# EAGLE design mutebox (EAGLE 6.3)

## Sheet 1 of 2
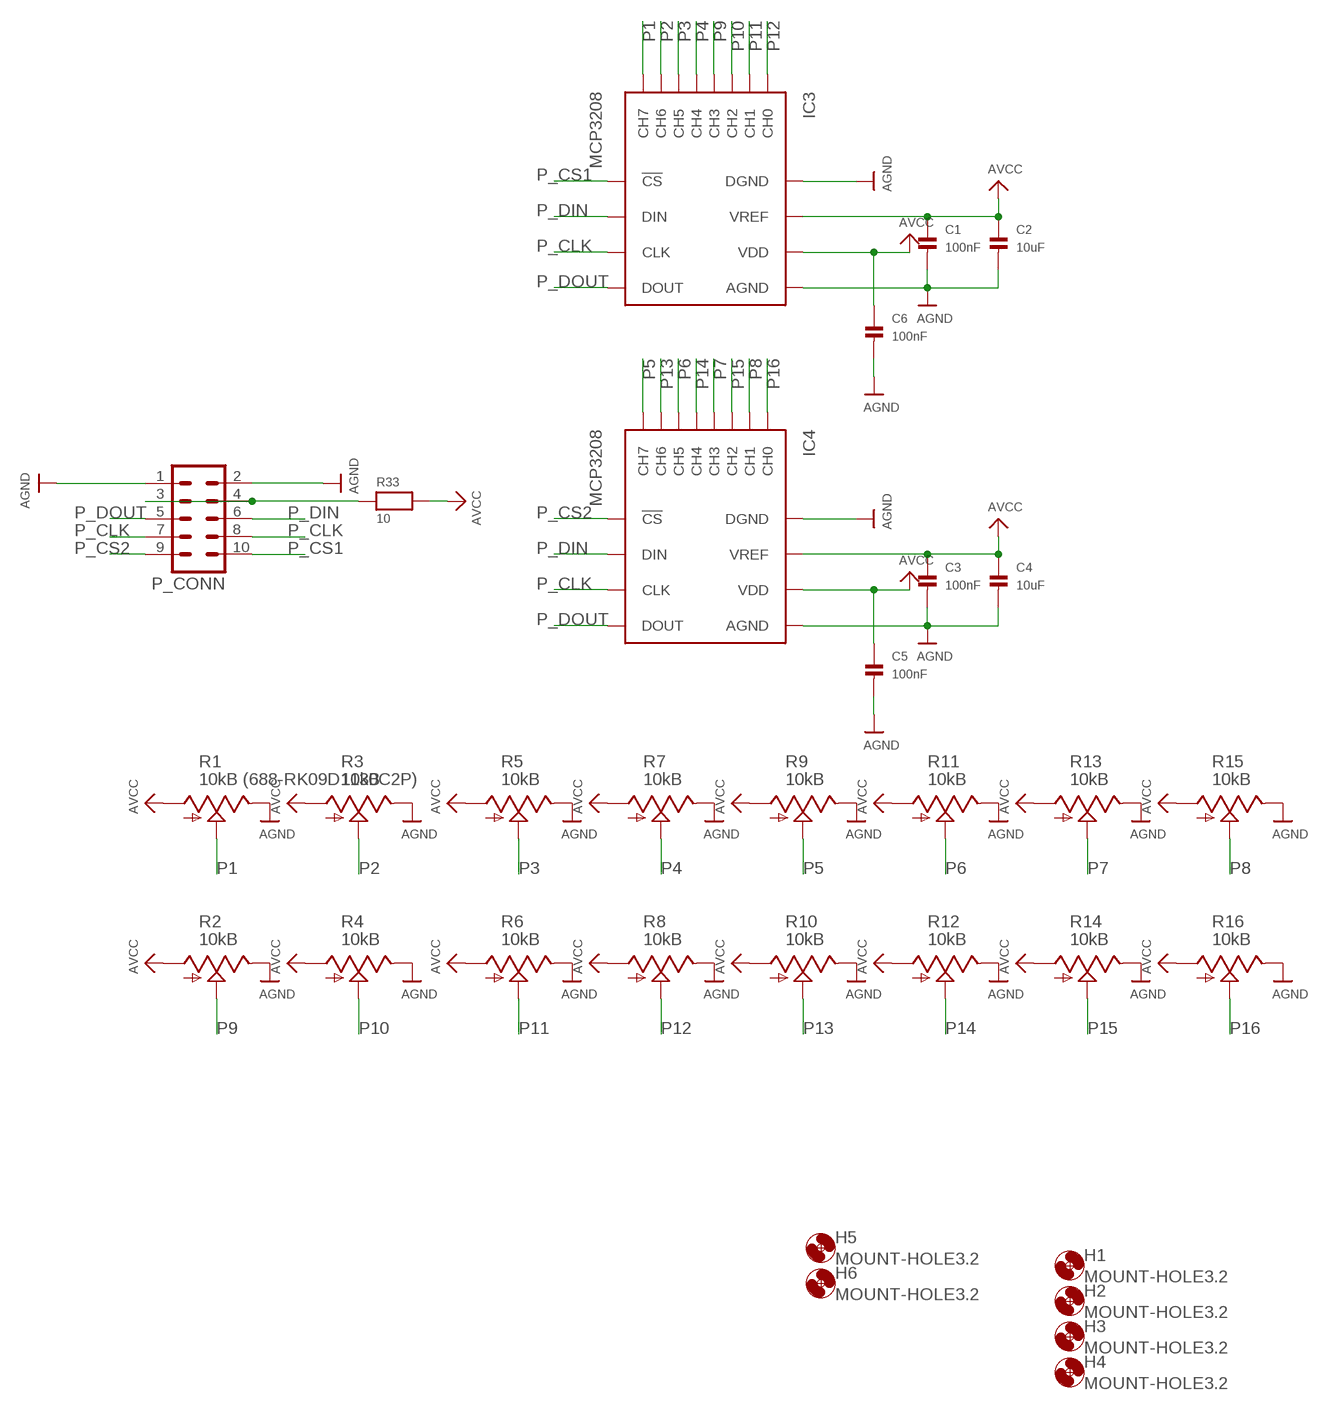
[diagram p0: schematic, sheet 1]

### Parts
C1  100nF  CAP_CERAMIC0603  [0603]
C2  10uF  CAP_CERAMIC_0805  [_0805]
C3  100nF  CAP_CERAMIC0603  [0603]
C4  10uF  CAP_CERAMIC_0805  [_0805]
C5  100nF  CAP_CERAMIC0603  [0603]
C6  100nF  CAP_CERAMIC0603  [0603]
H1  MOUNT-HOLE3.2  [3,2]
H2  MOUNT-HOLE3.2  [3,2]
H3  MOUNT-HOLE3.2  [3,2]
H4  MOUNT-HOLE3.2  [3,2]
H5  MOUNT-HOLE3.2  [3,2]
H6  MOUNT-HOLE3.2  [3,2]
IC3  MCP3208  21298E  [PDIP16]
IC4  MCP3208  21298E  [PDIP16]
P_CONN  ML10  [ML10]
R1  10kB (688-RK09D1130C2P)  POT_USVERTICAL_PS  [ALPS_POT_VERTICAL_PS]
R2  10kB  POT_USVERTICAL_PS  [ALPS_POT_VERTICAL_PS]
R3  10kB  POT_USVERTICAL_PS  [ALPS_POT_VERTICAL_PS]
R4  10kB  POT_USVERTICAL_PS  [ALPS_POT_VERTICAL_PS]
R5  10kB  POT_USVERTICAL_PS  [ALPS_POT_VERTICAL_PS]
R6  10kB  POT_USVERTICAL_PS  [ALPS_POT_VERTICAL_PS]
R7  10kB  POT_USVERTICAL_PS  [ALPS_POT_VERTICAL_PS]
R8  10kB  POT_USVERTICAL_PS  [ALPS_POT_VERTICAL_PS]
R9  10kB  POT_USVERTICAL_PS  [ALPS_POT_VERTICAL_PS]
R10  10kB  POT_USVERTICAL_PS  [ALPS_POT_VERTICAL_PS]
R11  10kB  POT_USVERTICAL_PS  [ALPS_POT_VERTICAL_PS]
R12  10kB  POT_USVERTICAL_PS  [ALPS_POT_VERTICAL_PS]
R13  10kB  POT_USVERTICAL_PS  [ALPS_POT_VERTICAL_PS]
R14  10kB  POT_USVERTICAL_PS  [ALPS_POT_VERTICAL_PS]
R15  10kB  POT_USVERTICAL_PS  [ALPS_POT_VERTICAL_PS]
R16  10kB  POT_USVERTICAL_PS  [ALPS_POT_VERTICAL_PS]
R33  10  RESISTOR_0805  [_0805]

### Nets
AGND: C1.2 C2.2 C3.2 C4.2 C5.2 C6.2 IC3.P$9(DGND) IC3.P$14(AGND) IC4.P$9(DGND) IC4.P$14(AGND) P_CONN.1 P_CONN.2 R1.P$1(E) R2.P$1(E) R3.P$1(E) R4.P$1(E) R5.P$1(E) R6.P$1(E) R7.P$1(E) R8.P$1(E) R9.P$1(E) R10.P$1(E) R11.P$1(E) R12.P$1(E) R13.P$1(E) R14.P$1(E) R15.P$1(E) R16.P$1(E)
AVCC: C1.1 C2.1 C3.1 C4.1 C5.1 C6.1 IC3.P$15(VREF) IC3.P$16(VDD) IC4.P$15(VREF) IC4.P$16(VDD) R1.P$3(A) R2.P$3(A) R3.P$3(A) R4.P$3(A) R5.P$3(A) R6.P$3(A) R7.P$3(A) R8.P$3(A) R9.P$3(A) R10.P$3(A) R11.P$3(A) R12.P$3(A) R13.P$3(A) R14.P$3(A) R15.P$3(A) R16.P$3(A) R33.2
N$9: P_CONN.3 P_CONN.4 R33.1
P1: IC3.P$8(CH7) R1.P$2(S)
P2: IC3.P$7(CH6) R3.P$2(S)
P3: IC3.P$6(CH5) R5.P$2(S)
P4: IC3.P$5(CH4) R7.P$2(S)
P5: IC4.P$8(CH7) R9.P$2(S)
P6: IC4.P$6(CH5) R11.P$2(S)
P7: IC4.P$4(CH3) R13.P$2(S)
P8: IC4.P$2(CH1) R15.P$2(S)
P9: IC3.P$4(CH3) R2.P$2(S)
P10: IC3.P$3(CH2) R4.P$2(S)
P11: IC3.P$2(CH1) R6.P$2(S)
P12: IC3.P$1(CH0) R8.P$2(S)
P13: IC4.P$7(CH6) R10.P$2(S)
P14: IC4.P$5(CH4) R12.P$2(S)
P15: IC4.P$3(CH2) R14.P$2(S)
P16: IC4.P$1(CH0) R16.P$2(S)
P_CLK: IC3.P$13(CLK) IC4.P$13(CLK) P_CONN.7 P_CONN.8
P_CS1: IC3.P$10(!CS) P_CONN.10
P_CS2: IC4.P$10(!CS) P_CONN.9
P_DIN: IC3.P$11(DIN) IC4.P$11(DIN) P_CONN.6
P_DOUT: IC3.P$12(DOUT) IC4.P$12(DOUT) P_CONN.5

## Sheet 2 of 2
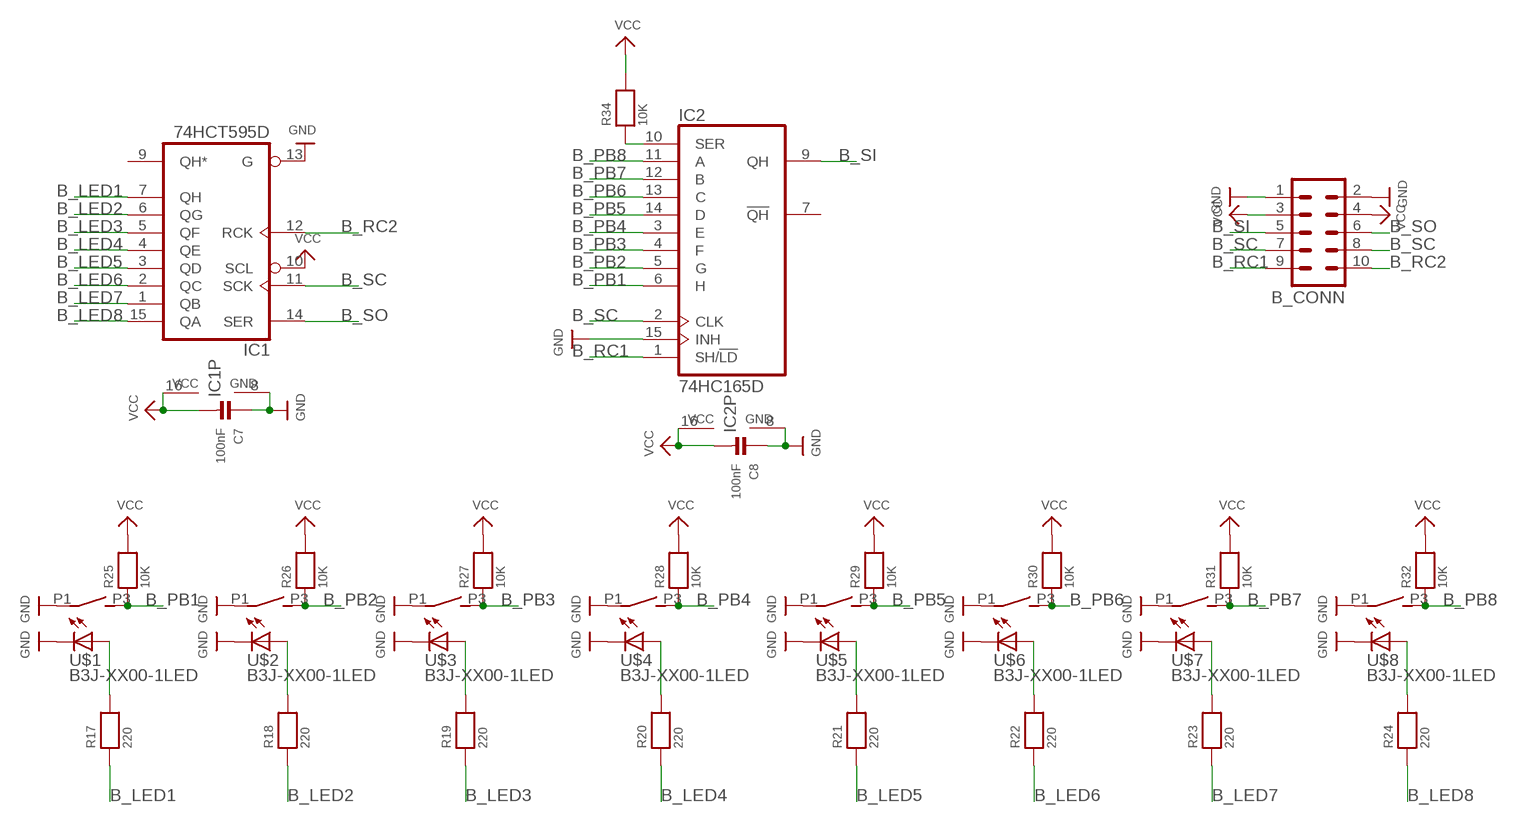
[diagram p1: schematic, sheet 2]

### Parts
B_CONN  ML10  [ML10]
C7  100nF  CAP_CERAMIC0603  [0603]
C8  100nF  CAP_CERAMIC0603  [0603]
IC1  74HCT595D  [SO16]
IC2  74HC165D  [SO16]
R17  220  RESISTOR_0603  [_0603]
R18  220  RESISTOR_0603  [_0603]
R19  220  RESISTOR_0603  [_0603]
R20  220  RESISTOR_0603  [_0603]
R21  220  RESISTOR_0603  [_0603]
R22  220  RESISTOR_0603  [_0603]
R23  220  RESISTOR_0603  [_0603]
R24  220  RESISTOR_0603  [_0603]
R25  10K  RESISTOR_0603  [_0603]
R26  10K  RESISTOR_0603  [_0603]
R27  10K  RESISTOR_0603  [_0603]
R28  10K  RESISTOR_0603  [_0603]
R29  10K  RESISTOR_0603  [_0603]
R30  10K  RESISTOR_0603  [_0603]
R31  10K  RESISTOR_0603  [_0603]
R32  10K  RESISTOR_0603  [_0603]
R34  10K  RESISTOR_0603  [_0603]
U$1  B3J-XX00-1LED  [B3J-XX00-1LED]
U$2  B3J-XX00-1LED  [B3J-XX00-1LED]
U$3  B3J-XX00-1LED  [B3J-XX00-1LED]
U$4  B3J-XX00-1LED  [B3J-XX00-1LED]
U$5  B3J-XX00-1LED  [B3J-XX00-1LED]
U$6  B3J-XX00-1LED  [B3J-XX00-1LED]
U$7  B3J-XX00-1LED  [B3J-XX00-1LED]
U$8  B3J-XX00-1LED  [B3J-XX00-1LED]

### Nets
B_LED1: IC1.7(QH) R17.1
B_LED2: IC1.6(QG) R18.1
B_LED3: IC1.5(QF) R19.1
B_LED4: IC1.4(QE) R20.1
B_LED5: IC1.3(QD) R21.1
B_LED6: IC1.2(QC) R22.1
B_LED7: IC1.1(QB) R23.1
B_LED8: IC1.15(QA) R24.1
B_PB1: IC2.6(H) R25.1 U$1.P3(SW2)
B_PB2: IC2.5(G) R26.1 U$2.P3(SW2)
B_PB3: IC2.4(F) R27.1 U$3.P3(SW2)
B_PB4: IC2.3(E) R28.1 U$4.P3(SW2)
B_PB5: IC2.14(D) R29.1 U$5.P3(SW2)
B_PB6: IC2.13(C) R30.1 U$6.P3(SW2)
B_PB7: IC2.12(B) R31.1 U$7.P3(SW2)
B_PB8: IC2.11(A) R32.1 U$8.P3(SW2)
B_RC1: B_CONN.9 IC2.1(SH/!LD)
B_RC2: B_CONN.10 IC1.12(RCK)
B_SC: B_CONN.7 B_CONN.8 IC1.11(SCK) IC2.2(CLK)
B_SI: B_CONN.5 IC2.9(QH)
B_SO: B_CONN.6 IC1.14(SER)
GND: B_CONN.1 B_CONN.2 C7.1 C8.1 IC1.8(GND) IC1.13(G) IC2.8(GND) IC2.15(INH) U$1.LED- U$1.P1(SW1) U$2.LED- U$2.P1(SW1) U$3.LED- U$3.P1(SW1) U$4.LED- U$4.P1(SW1) U$5.LED- U$5.P1(SW1) U$6.LED- U$6.P1(SW1) U$7.LED- U$7.P1(SW1) U$8.LED- U$8.P1(SW1)
N$1: R17.2 U$1.LED+
N$2: R18.2 U$2.LED+
N$3: R19.2 U$3.LED+
N$4: R20.2 U$4.LED+
N$5: R21.2 U$5.LED+
N$6: R22.2 U$6.LED+
N$7: R23.2 U$7.LED+
N$8: R24.2 U$8.LED+
N$10: IC2.10(SER) R34.1
VCC: B_CONN.3 B_CONN.4 C7.2 C8.2 IC1.10(SCL) IC1.16(VCC) IC2.16(VCC) R25.2 R26.2 R27.2 R28.2 R29.2 R30.2 R31.2 R32.2 R34.2
Unconnected: IC1.9(QH*) IC2.7(!QH)

## Library data of the parts
B_CONN P_CONN = con-harting-ml:ML10: HARTING; OC_FARNELL: unknown; OC_NEWARK: unknown
C1-C8 = microbuilder:CAP_CERAMIC: Ceramic Capacitors 0402 - 0402 Surface Mount Capacitors 16pF 50V 5% [Digikey: 445-4899-2-ND] 18pF 50V 5% [Digikey: 490-1281-2-ND] 22pF 50V 5% [Digikey: 490-1283-2-ND] 68pF 50V 5% [Digikey: 490-1289-2-ND] 0.1uF 10V 10% [Digikey: 490-1318-2-ND] 1.0uF 6.3V 10% [Digikey: 490-1320-2-ND] 0603 - 0603 Surface Mount Capacitors 16 pF 50V 5% [Digikey: 445-5051-2-ND] 22 pF 50V [Digikey: PCC220ACVTR-ND] 33 pF 50V 5% [Digikey: 490-1415-1-ND] 56pF 50V 5% [Digikey: 490-1421-1-ND] 220pF 50V 5% [Digikey: 445-1285-1-ND] 680 pF 50V 2200 pF 50V 5% C0G [Digikey: 445-1297-1-ND] 5600 pF 100V 5% X7R [Digikey: 478-3711-1-ND] 0.1 µF 25V 10% [Digikey: PCC2277TR-ND] 0.22 µF 16V 10% X7R [Digikey: 445-1318-1-ND] 1.0 µF 25V 10% [Digikey: 445-5146-2-ND] 0603 - RF Specific 3pF 250V +/-0.1pF RF [Digikey: 712-1347-1-ND] 18 pF 250V 5% [Digikey: 478-3505-1-ND or 712-1322-1-ND] 56 pF 250V 5% C0G RF [Digikey: 490-4867-1-ND] 68 pF 250V RF [Digikey: 490-4868-1-ND] 0805 - 0805 Surface Mount Capacitors 220 pF 250V 2% RF Ceramic Capacitor [Digikey: 712-1398-1-ND] 1000 pF 50V 2% NP0 Ceramic Capacitor [Digikey: 478-3760-1-ND] 0.1 µF 25V 10% Ceramic Capacitor [Digikey: PCC1828TR-ND] 1.0 µF 16V 10% Ceramic Capacitor[Digikey: 490-1691-2-ND] 10.0 µF 10V 10% Ceramic Capacitor[Digikey: 709-1228-1-ND] 10.0 uF 16V 10% Ceramic Capacitor [Digikey: 478-5165-2-ND] 47 uF 6.3V 20% Ceramic Capacitor [Digikey: 587-1779-1-ND or 399-5506-1-ND] 1206 - 1206 Surface Mount Capacitors 47uF 10V 20% Ceramic Capacitor [Digikey: 490-5528-1-ND or 399-5508-1-ND or 445-6010-1-ND] 100uF 6.3V -20%, +80% Y5V Ceramic Capacitor (Digikey: 490-4512-1-ND, Mouser: 81-GRM31CF50J107ZE1L)
H1-H6 = holes:MOUNT-HOLE: MOUNTING HOLE with drill center marker
IC1 = 74xx-eu:74*595: 8-bit SHIFT REGISTER, output latch
IC2 = 74xx-eu:74*165: 8-bit parallel load SHIFT REGISTER
IC3 IC4 = MCP3208:21298E
R1-R16 = pot-alps:POT_US
R17-R34 = microbuilder:RESISTOR: Resistors 0402 - 0402 Surface Mount Package 22 Ohm 1% 1/16W [Digikey: 311-22.0LRTR-ND] 33 Ohm 5% 1/16W 1.0K 5% 1/16W 1.5K 5% 1/16W 2.0K 1% 1/16W 10.0K 1% 1/16W [Digikey: 311-10.0KLRTR-ND] 10.0K 5% 1/16W [Digikey: RMCF0402JT10K0TR-ND] 12.1K 1% 1/16W [Digikey: 311-22.0LRTR-ND] 100.0K 5% 1/16W 0603 - 0603 Surface Mount Package 0 Ohm 1/10 Watt 1% Resistor 15 Ohm 1/10 Watt 1% Resistor 33 Ohm 1/10 Watt 1% Resistor 49.9 Ohm 1/10 Watt 1% Resistor 100 Ohm 1/10 Watt 1% Resistor 150 Ohm 1/10 Watt 1% Resistor 240 Ohm 1/10 Watt 1% Resistor 390 Ohm 1/10 Watt 1% Resistor 560 Ohm 1/10 Watt 1% Resistor 680 Ohm 1/10 Watt 1% Resistor 750 Ohm 1/10 Watt 1% Resistor 1.0K Ohm 1/10 Watt 1% Resistor 1.5K Ohm 1/10 Watt 1% Resistor 2.0K Ohm 1/10 Watt 1% Resistor 2.2K Ohm 1/10 Watt 1% Resistor 3.3K Ohm 1/10 Watt 1% Resistor 4.7K Ohm 1/10 Watt 1% Resistor 10.0K Ohm 1/10 Watt 1% Resistor 12.0K Ohm 1/10 Watt 1% Resistor 12.1K Ohm 1/10 Watt 1% Resistor 20.0K Ohm 1/10 Watt 1% Resistor 33.0K Ohm 1/10 Watt 1% Resistor 100.0K Ohm 1/10 Watt 1% Resistor 0805 - 0805 Surface Mount Package 0 Ohm 1/8 Watt 1% Resistor 33 Ohm 1/8 Watt 1% Resistor 100 Ohm 1/8 Watt 1% Resistor 150 Ohm 1/8 Watt 1% Resistor 200 Ohm 1/8 Watt 1% Resistor 240 Ohm 1/8 Watt 1% Resistor 330 Ohm 1/8 Watt 1% Resistor 390 Ohm 1/8 Watt 1% Resistor 470 Ohm 1/8 Watt 1% Resistor 1.0K Ohm 1/8 Watt 1% Resistor 1.5K Ohm 1/8 Watt 1% Resistor 2.0K Ohm 1/8 Watt 1% Resistor 4.7K Ohm 1/8 Watt 1% Resistor 5.1K Ohm 1/8 Watt 1% Resistor 5.6K Ohm 1/8 Watt 1% Resistor 10.0K Ohm 1/8 Watt 1% Resistor 22.0K Ohm 1/8 Watt 1% Resistor 33.0K Ohm 1/8 Watt 1% Resistor 100K Ohm 1/8 Watt 1% Resistor 1206 - 1206 Surface Mount Package 2012 - 2010 Surface Mount Package 0.11 Ohm 1/2 Watt 1% Resistor - Digikey: RHM.11UCT-ND
U$1-U$8 = keves:B3J-XX00-1LED

## Board
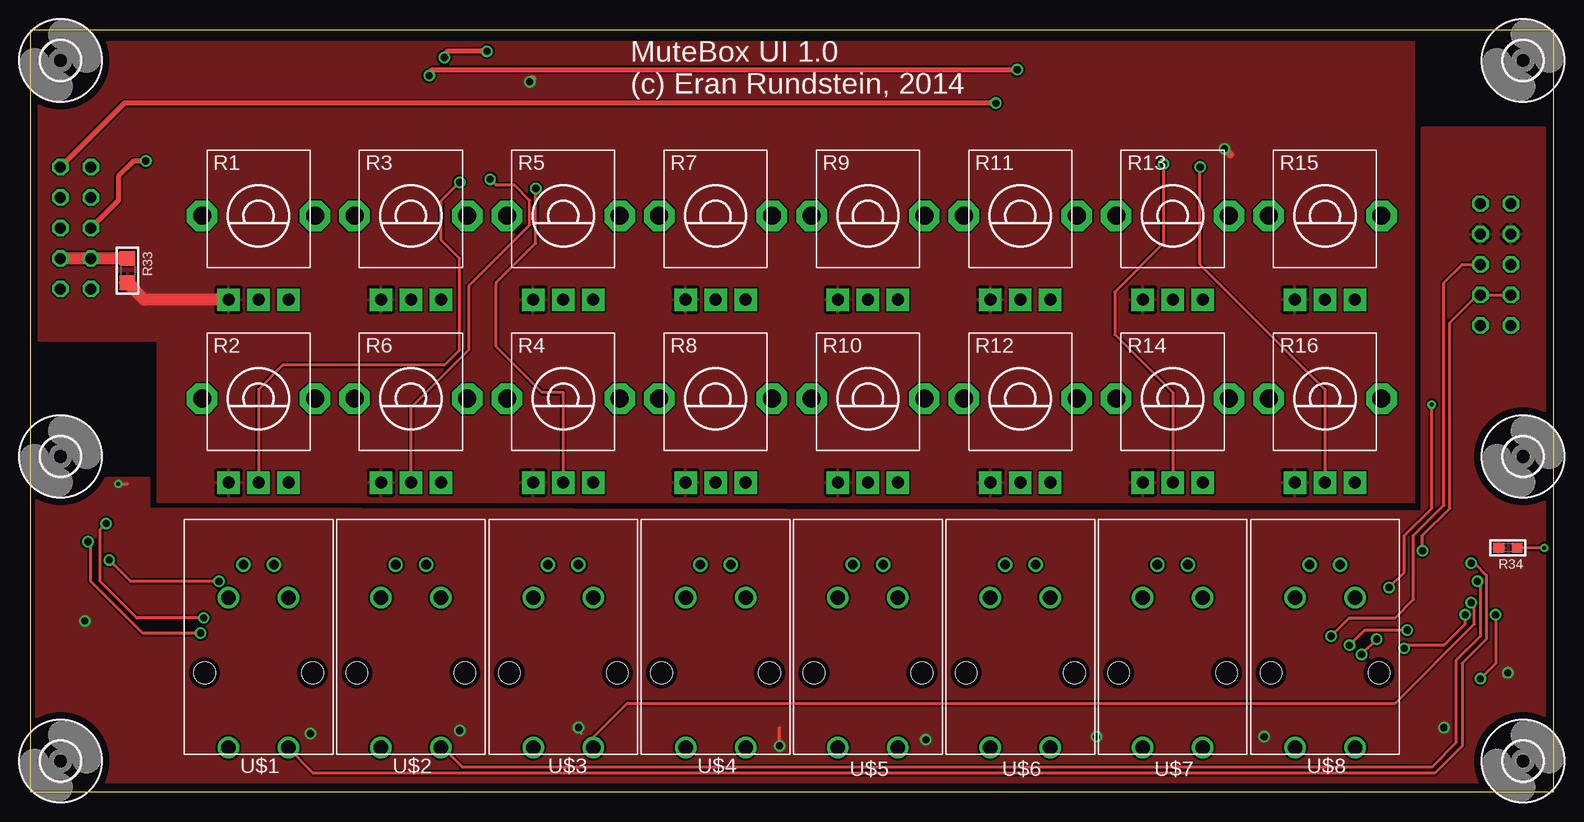
[diagram p2: board, top side]
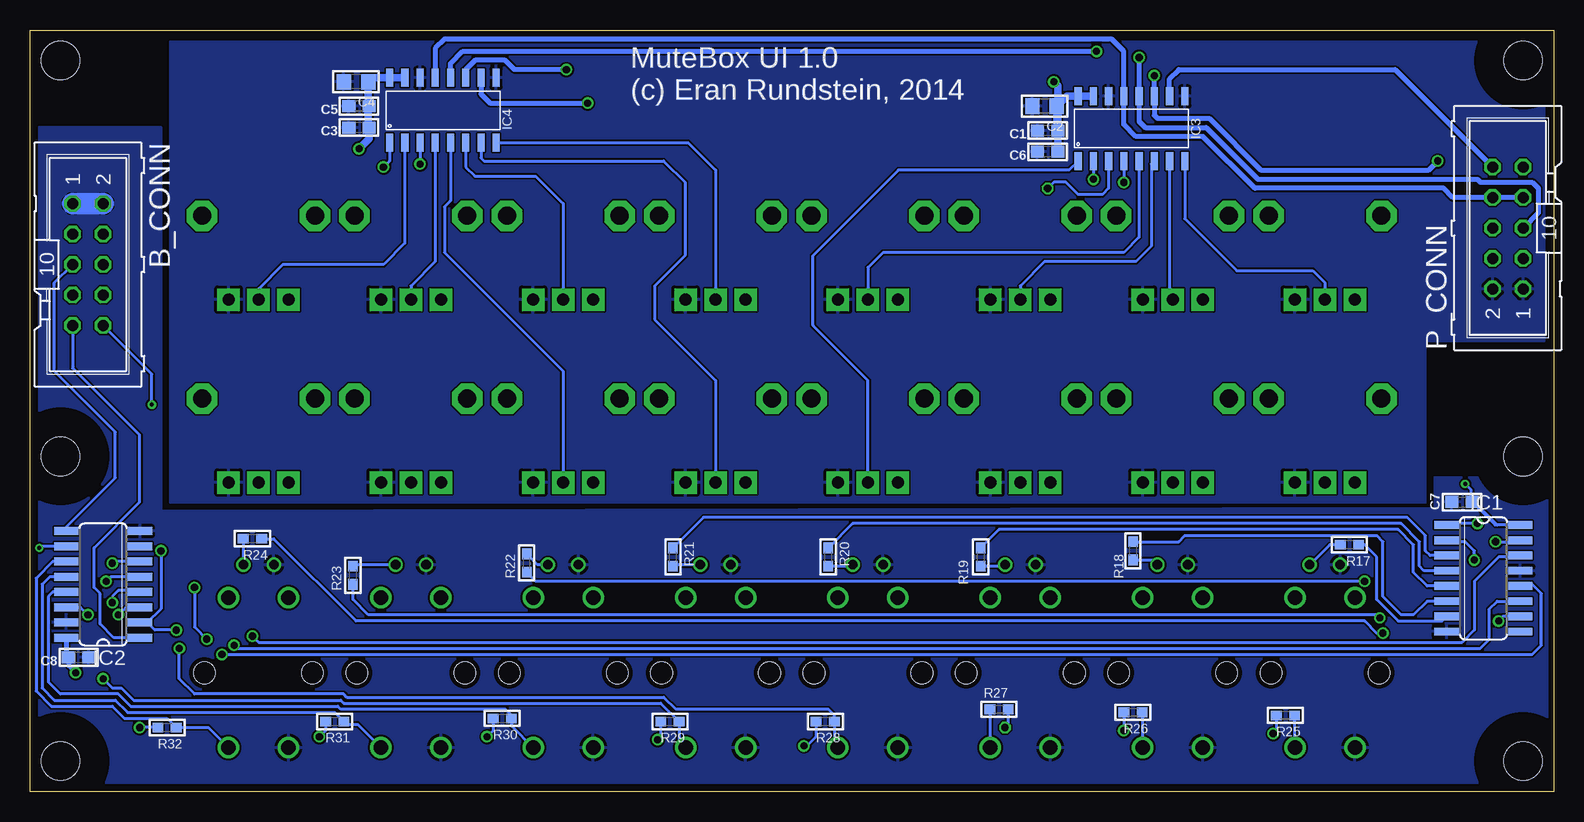
[diagram p3: board, bottom side, seen from below]

Size 127 x 63.5 mm. Coordinates in mm from the lower left corner, seen from the top.
Outline: 0,0 127,0 127,63.5 0,63.5 0,0
Copper layers (1*16): Top 0.0356mm / dielectric 1.5011mm / Bottom 0.0356mm
Design rules "oshpark_2layer *": minimum track width 6mil, minimum drill 13mil, track to track 6mil, track to pad 6mil, pad to pad 6mil, via to via 6mil, smd to smd 6mil, copper to edge 15mil, drill to drill 6mil, minimum pad ring 7mil, minimum via ring 7mil, stop-mask expansion 3mil, vias tented up to drill 0mil, thermal gap 10mil

### Footprints (pad centres in the part's own frame; a part is rotated, then mirrored left to right if it is on the bottom)
ML10 = drill 0.914 octagon: 1 -5.08,-1.27; 2 -5.08,1.27; 3 -2.54,-1.27; 4 -2.54,1.27; 5 0,-1.27; 6 0,1.27; 7 2.54,-1.27; 8 2.54,1.27; 9 5.08,-1.27; 10 5.08,1.27
0603 = smd 1.1 x 1: 1 -0.85,0; 2 0.85,0
_0805 = smd 1.2 x 1.3: 1 -1.016,0; 2 1.016,0
3,2 = hole 3.2: 0,0
SO16 = smd 0.66 x 2.032: 1 -4.445,-3.073; 2 -3.175,-3.073; 3 -1.905,-3.073; 4 -0.635,-3.073; 5 0.635,-3.073; 6 1.905,-3.073; 7 3.175,-3.073; 8 4.445,-3.073; 9 4.445,3.073; 10 3.175,3.073; 11 1.905,3.073; 12 0.635,3.073; 13 -0.635,3.073; 14 -1.905,3.073; 15 -3.175,3.073; 16 -4.445,3.073
PDIP16 = smd 0.6 x 1.5: P$1 0,0; P$2 1.27,0; P$3 2.54,0; P$4 3.81,0; P$5 5.08,0; P$6 6.35,0; P$7 7.62,0; P$8 8.89,0; P$9 8.89,5.4; P$10 7.62,5.4; P$11 6.35,5.4; P$12 5.08,5.4; P$13 3.81,5.4; P$14 2.54,5.4; P$15 1.27,5.4; P$16 0,5.4
ALPS_POT_VERTICAL_PS = drill 1 pad 1.88 square: P$1 -2.5,7; P$2 0,7; P$3 2.5,7 | drill 1.5 pad 2.54 octagon: P$4 -4.7,0; P$5 4.7,0
_0603 = smd 0.9 x 0.8: 1 -0.762,0; 2 0.762,0
B3J-XX00-1LED = drill 0.8: LED+ 1.27,9; LED- -1.27,9 | drill 1.2: P1 -2.5,-6.25; P2 -2.5,6.25; P3 2.5,-6.25; P4 2.5,6.25 | hole 1.8: -4.5,0; 4.5,0

### Placement (x,y rotation side)
B_CONN  122.17,43.94 270 bottom
C1  42.16,55.12 180 bottom
C2  42.42,57.15 180 bottom
C3  99.57,55.37 180 bottom
C4  99.82,59.18 180 bottom
C5  99.57,57.15 180 bottom
C6  42.16,53.34 180 bottom
C7  7.62,24.13 0 bottom
C8  122.94,11.18 180 bottom
H1  2.54,2.54 0 top
H2  124.46,2.54 0 top
H3  2.54,60.96 0 top
H4  124.46,60.96 0 top
H5  2.54,27.94 0 top
H6  124.46,27.94 0 top
IC1  5.84,17.78 270 bottom
IC2  120.9,17.27 90 bottom
IC3  39.62,52.58 0 bottom
IC4  97.03,54.1 0 bottom
P_CONN  3.81,46.99 90 bottom
R1  19.05,48.01 180 top
R2  19.05,32.77 180 top
R3  31.75,48.01 180 top
R4  44.45,32.77 180 top
R5  44.45,48.01 180 top
R6  31.75,32.77 180 top
R7  57.15,48.01 180 top
R8  57.15,32.77 180 top
R9  69.85,48.01 180 top
R10  69.85,32.77 180 top
R11  82.55,48.01 180 top
R12  82.55,32.77 180 top
R13  95.25,48.01 180 top
R14  95.25,32.77 180 top
R15  107.95,48.01 180 top
R16  107.95,32.77 180 top
R17  17.02,20.57 180 bottom
R18  35.05,20.07 270 bottom
R19  47.75,19.56 270 bottom
R20  60.45,19.56 270 bottom
R21  73.41,19.56 270 bottom
R22  85.6,19.05 90 bottom
R23  100.08,18.03 90 bottom
R24  108.46,21.08 180 bottom
R25  22.35,6.35 180 bottom
R26  35.05,6.6 180 bottom
R27  46.23,6.86 0 bottom
R28  60.71,5.84 180 bottom
R29  73.66,5.84 180 bottom
R30  87.63,6.1 180 bottom
R31  101.6,5.84 180 bottom
R32  115.57,5.33 180 bottom
R33  8.13,43.43 270 top
R34  123.19,20.32 180 top
U$1  19.05,9.91 0 top
U$2  31.75,9.91 0 top
U$3  44.45,9.91 0 top
U$4  57.15,9.91 0 top
U$5  69.85,9.91 0 top
U$6  82.55,9.91 0 top
U$7  95.25,9.91 0 top
U$8  107.95,9.91 0 top

### Tracks (layer width: path | path; a pad name or v marks a point on that pad's centre or on a via)
AGND
  pour Bottom: 0.76,62.48 115.32,62.48 115.32,24.13 10.67,24.13 10.67,37.59 0.76,37.59
AVCC  (via drill 0.6)
  Top 0.61: v99.57,53.59 100.08,53.09 | v41.66,59.18 41.91,59.44
  Top 1.016: R1.P$3 9.54,41.01 R33.2
  Bottom 0.61: v99.57,53.59 98.72,54.44 C3.1 98.81,55.46 98.81,57.15 C5.1 98.81,57.24 C4.1 98.49,59.5 IC4.P$16 IC4.P$15 | IC3.P$15 IC3.P$16 40.57,57.98 C2.1 41.4,55.21 C1.1 C6.1 41.31,58.84 v41.66,59.18
  pour Top: 0.76,62.48 115.32,62.48 115.32,24.13 10.67,24.13 10.67,37.59 0.76,37.59
B_LED1
  Bottom 0.254: R17.1 15.75,20.57 14.73,19.56 14.73,16 12.95,14.22 9.3,14.22 IC1.7 9.04,14.48
B_LED2
  Bottom 0.254: R18.1 31.24,20.83 30.73,21.34 14.73,21.34 14.22,20.83 14.22,16.26 12.7,14.73 11.68,14.73 10.54,15.88 IC1.6
B_LED3
  Bottom 0.254: IC1.5 10.54,17.14 11.68,18.29 11.68,20.57 12.95,21.84 46.23,21.84 R19.1
B_LED4
  Bottom 0.254: IC1.4 10.79,18.41 11.18,18.8 11.18,20.83 12.7,22.35 58.42,22.35 R20.1
B_LED5
  Bottom 0.254: IC1.3 10.29,19.68 10.67,20.07 10.67,21.34 12.19,22.86 70.87,22.86 R21.1
B_LED6  (via drill 0.6)
  Top 0.254: v15.75,17.53 8.38,17.53 v6.6,19.3
  Bottom 0.254: v15.75,17.53 84.84,17.53 R22.1 | v6.6,19.3 6.6,20.07 7.37,20.83 8.79,20.83 IC1.2
B_LED7  (via drill 0.6)
  Top 0.254: v14.48,14.48 8.89,14.48 5.84,17.53 5.84,21.84 v6.35,22.35
  Bottom 0.254: v14.48,14.48 14.73,14.73 98.81,14.73 100.08,16 R23.1 | v6.35,22.35 8.79,22.35 IC1.1
B_LED8  (via drill 0.6)
  Top 0.254: v14.22,13.21 9.4,13.21 5.08,17.53 5.08,20.57 v4.83,20.83
  Bottom 0.254: v4.83,20.83 2.9,20.83 IC1.15 | v14.22,13.21 14.73,13.21 15.75,14.22 99.82,14.22 106.68,21.08 R24.1
B_PB1  (via drill 0.6)
  Top 0.254: v120.14,19.05 120.4,19.05 121.41,18.03 121.41,12.7 119.38,10.67 119.38,3.81 117.09,1.52 23.62,1.52 21.55,3.6 U$1.P3
  Bottom 0.254: IC2.6 120.02,19.18 v120.14,19.05 | R25.1 21.59,3.7 U$1.P3
B_PB2  (via drill 0.6)
  Top 0.254: v120.65,17.53 120.9,17.27 120.9,12.95 118.87,10.92 118.87,4.06 116.84,2.03 36.07,2.03 34.44,3.66 U$2.P3
  Bottom 0.254: IC2.5 120.27,17.91 v120.65,17.53 | R26.1 34.29,3.7 U$2.P3
B_PB3  (via drill 0.6)
  Top 0.254: v120.14,15.75 120.4,15.49 120.4,13.97 113.79,7.37 49.78,7.37 46.95,4.53 U$3.P3
  Bottom 0.254: IC2.4 117.96,16.76 119.63,16.76 120.14,16.26 v120.14,15.75 | R27.1 46.99,3.7 U$3.P3
B_PB4  (via drill 0.6)
  Top 0.254: v119.63,14.73 119.63,13.97 117.86,12.19 114.81,12.19 v114.55,11.94
  Bottom 0.254: IC2.3 119,15.37 v119.63,14.73 | U$4.P3 59.94,3.95 R28.1 59.94,6.35 60.45,6.86 73.15,6.86 74.17,7.87 100.58,7.87 100.84,8.13 113.28,8.13 114.55,9.4 v114.55,11.94
B_PB5  (via drill 0.6)
  Top 0.254: v122.17,14.73 122.17,10.67 v120.9,9.4
  Bottom 0.254: IC2.14 122.81,15.37 v122.17,14.73 | v120.9,9.4 120.14,8.64 119.38,8.64 118.36,7.62 101.09,7.62 100.84,7.37 74.42,7.37 R29.1 72.9,4.2 U$5.P3
B_PB6
  Bottom 0.254: IC2.13 125.09,16.64 125.48,16.26 125.48,9.14 124.46,8.13 119.63,8.13 118.62,7.11 101.35,7.11 101.09,6.86 87.38,6.86 86.87,6.35 R30.1 86.87,5.47 U$6.P3
B_PB7
  Bottom 0.254: IC2.12 125.35,17.91 125.98,17.27 125.98,8.64 124.97,7.62 119.89,7.62 118.87,6.6 101.6,6.6 R31.1 100.84,5.59 99.68,5.59 U$7.P3
B_PB8
  Bottom 0.254: IC2.11 125.09,19.18 126.49,17.78 126.49,8.38 125.22,7.11 120.14,7.11 119.13,6.1 115.57,6.1 R32.1 112.13,5.33 U$8.P3
B_RC1
  Bottom 0.254: IC2.1 120.02,12.83 121.16,13.97 121.16,16.51 121.67,17.02 121.67,20.32 117.86,24.13 117.86,29.72 123.44,35.31 B_CONN.9
B_RC2  (via drill 0.33, 0.6)
  Top 0.254: v112.27,12.7 v111,11.43 | v113.28,17.02 114.55,18.29 114.55,21.34 116.84,23.62 v116.84,32.26
  Bottom 0.254: v111,11.43 1.78,11.43 1.02,12.19 1.02,16.51 1.78,17.27 2.64,17.27 IC1.12 | v112.27,12.7 113.28,13.72 v113.28,17.02 | v116.84,32.26 116.84,34.8 B_CONN.10
B_SC  (via drill 0.6)
  Top 0.254: v109.98,12.19 111.25,13.46 v114.81,13.46 | v116.08,20.07 116.08,21.34 118.36,23.62 118.36,39.12 120.65,41.4 B_CONN.8 B_CONN.7
  Bottom 0.254: 2.9,16 IC1.11 4.7,15.88 5.33,15.24 5.33,12.7 6.1,11.94 109.73,11.94 v109.98,12.19 | v116.08,20.07 116.08,15.24 117.22,14.1 | IC2.2 117.22,14.1 | v114.81,13.46 116.59,13.46 117.22,14.1
B_SI
  Bottom 0.254: IC2.9 123.98,22.07 119.89,26.16 119.89,29.97 124.97,35.05 124.97,42.42 B_CONN.5
B_SO  (via drill 0.6)
  Top 0.254: v108.46,12.95 109.98,14.48 113.79,14.48 115.32,16 115.32,21.34 117.86,23.88 117.86,42.42 119.38,43.94 B_CONN.6
  Bottom 0.254: IC1.14 2.9,19.56 4.57,19.56 6.6,17.53 6.6,13.46 7.62,12.45 107.95,12.45 v108.46,12.95
GND
  Bottom 1.778: B_CONN.1 B_CONN.2
  pour Bottom: 116.08,55.37 126.24,55.37 126.24,0.76 0.51,0.76 0.51,26.16 9.91,26.16 9.91,23.62 116.08,23.37
N$1
  Bottom 0.254: R17.2 18.65,20.57 U$1.LED+
N$2
  Bottom 0.254: R18.2 33.42,19.3 U$2.LED+
N$3
  Bottom 0.254: R19.2 45.83,18.8 U$3.LED+
N$4
  Bottom 0.254: R20.2 58.53,18.8 U$4.LED+
N$5
  Bottom 0.254: U$5.LED+ 73.3,18.91 R21.2
N$6
  Bottom 0.254: U$6.LED+ 84.69,18.91 R22.2
N$7
  Bottom 0.254: U$7.LED+ 99.97,18.91 R23.2
N$8
  Bottom 0.254: R24.2 U$8.LED+
N$9
  Top 1.016: P_CONN.3 P_CONN.4 R33.1
N$10  (via drill 0.33)
  Top 0.254: v126.24,20.32 R34.1
  Bottom 0.254: IC2.10 126.11,20.45 v126.24,20.32
P1
  Bottom 0.254: IC3.P$8 30.73,47.75 26.42,43.43 20.07,43.43 19.05,42.42 R1.P$2
P2
  Bottom 0.254: IC3.P$7 32,41.26 R3.P$2
P3
  Bottom 0.254: IC3.P$6 33.53,52.32 33.53,45.47 34.8,44.2 42.42,44.2 44.45,42.16 R5.P$2
P4
  Bottom 0.254: IC3.P$5 34.54,46.23 35.81,44.96 55.88,44.96 57.15,43.69 R7.P$2
P5
  Bottom 0.254: IC4.P$8 72.14,54.1 69.85,51.82 R9.P$2
P6
  Bottom 0.254: IC4.P$6 90.68,52.07 89.92,51.31 84.84,51.31 82.55,49.02 R11.P$2
P7
  Bottom 0.254: IC4.P$4 93.22,44.2 95.25,42.16 R13.P$2
P8
  Bottom 0.254: IC4.P$2 95.76,45.72 97.54,43.94 105.92,43.94 107.95,41.91 R15.P$2
P9  (via drill 0.6)
  Top 0.254: R2.P$2 19.05,33.53 21.08,35.56 34.54,35.56 35.81,36.83 35.81,44.45 34.29,45.97 34.29,49.28 v35.81,50.8
  Bottom 0.254: IC3.P$4 v35.81,50.8
P10  (via drill 0.6)
  Top 0.254: R4.P$2 44.45,33.27 42.67,33.27 38.86,37.08 38.86,42.42 42.16,45.72 v42.16,50.29
  Bottom 0.254: IC3.P$3 37.08,50.29 37.59,49.78 39.62,49.78 40.64,50.8 41.66,50.8 v42.16,50.29
P11  (via drill 0.6)
  Top 0.254: R6.P$2 31.75,32 36.58,36.83 36.58,42.16 41.66,47.24 41.66,49.28 40.39,50.55 38.86,50.55 v38.35,51.05
  Bottom 0.254: IC3.P$2 v38.35,51.05
P12
  Bottom 0.254: IC3.P$1 40.39,51.82 54.61,51.82 61.72,44.7 61.72,38.86 57.15,34.29 R8.P$2
P13
  Bottom 0.254: IC4.P$7 89.41,52.83 89.15,52.58 74.17,52.58 72.39,50.8 72.39,44.7 74.93,42.16 74.93,39.37 69.85,34.29 R10.P$2
P14
  Bottom 0.254: IC4.P$5 91.95,49.28 92.46,48.77 92.46,44.96 82.55,35.05 R12.P$2
P15  (via drill 0.6)
  Top 0.254: v94.49,52.32 94.49,45.72 90.42,41.66 90.42,38.1 95.25,33.27 R14.P$2
  Bottom 0.254: IC4.P$3 v94.49,52.32
P16  (via drill 0.6)
  Top 0.254: R16.P$2 107.95,33.53 97.54,43.94 v97.54,52.07
  Bottom 0.254: IC4.P$1 97.03,52.58 v97.54,52.07
P_CLK
  Bottom 0.406: IC4.P$13 93.22,61.98 92.46,62.74 36.83,62.74 35.81,61.72 IC3.P$13 35.81,55.63 34.8,54.61 29.21,54.61 24.89,50.29 9.14,50.29 8.38,49.53 P_CONN.8 P_CONN.7
P_CS1
  Bottom 0.406: IC3.P$10 32,59.44 31.24,60.2 13.21,60.2 P_CONN.10
P_CS2  (via drill 0.6)
  Top 0.406: v80.52,57.4 7.87,57.4 P_CONN.9
  Bottom 0.406: IC4.P$10 89.41,58.17 88.65,57.4 v80.52,57.4
P_DIN  (via drill 0.6)
  Top 0.406: v9.65,52.58 8.64,52.58 7.37,51.31 7.37,49.28 P_CONN.6 | v33.27,59.69 33.27,59.94 33.53,60.2 v82.3,60.2
  Bottom 0.406: v9.65,52.58 10.41,51.82 24.38,51.82 28.7,56.13 33.02,56.13 33.27,56.39 IC3.P$11 v33.27,59.69 | v82.3,60.2 86.61,60.2 87.38,60.96 89.92,60.96 90.68,60.2 IC4.P$11
P_DOUT  (via drill 0.6)
  Top 0.406: v38.1,61.72 34.8,61.72 34.54,61.47 v34.54,61.21
  Bottom 0.406: IC4.P$12 91.95,60.71 90.93,61.72 v38.1,61.72 | v34.54,61.21 IC3.P$12 34.54,55.88 34.04,55.37 28.96,55.37 24.64,51.05 6.35,51.05 6.1,50.8 1.78,50.8 1.27,50.29 1.27,48.26 P_CONN.5
VCC  (via drill 0.33, 0.6)
  Top 0.254: v117.86,5.33 118.11,5.33 | v102.87,4.57 103.12,4.32 | v88.9,4.57 89.15,4.32 | v74.68,4.32 74.93,4.06 | v62.48,3.81 62.48,5.33 | v35.81,5.08 36.07,4.83 | v23.37,4.83 23.62,4.57 | v4.57,14.22 4.57,13.97 | v45.72,5.33 45.72,5.08 45.97,4.83 | v7.37,25.65 8.13,25.65
  Top 0.406: v123.19,9.91 122.94,9.65
  Bottom 0.254: R32.2 v117.86,5.33 | R31.2 102.36,5.08 v102.87,4.57 | R30.2 88.39,5.08 v88.9,4.57 | R29.2 74.42,4.57 v74.68,4.32 | R28.2 61.47,4.57 62.23,3.81 v62.48,3.81 | R26.2 v35.81,5.08 | R25.2 23.11,5.08 v23.37,4.83 | IC1.10 4.19,14.61 v4.57,14.22 | R27.2 45.47,5.59 v45.72,5.33 | C7.2 4.87,22.23 IC1.16 4.7,22.23 6.86,24.38 6.86,25.15 v7.37,25.65
  Bottom 0.406: IC2.16 123.98,11.37 C8.2 123.79,10.5 v123.19,9.91
  pour Top: 116.08,55.37 126.24,55.37 126.24,0.76 0.51,0.76 0.51,26.16 9.91,26.16 9.91,23.62 116.08,23.37

### Text on the board
tPlace: MuteBox UI 1.0 / (c) Eran Rundstein, 2014
bPlace: MuteBox UI 1.0 / (c) Eran Rundstein, 2014